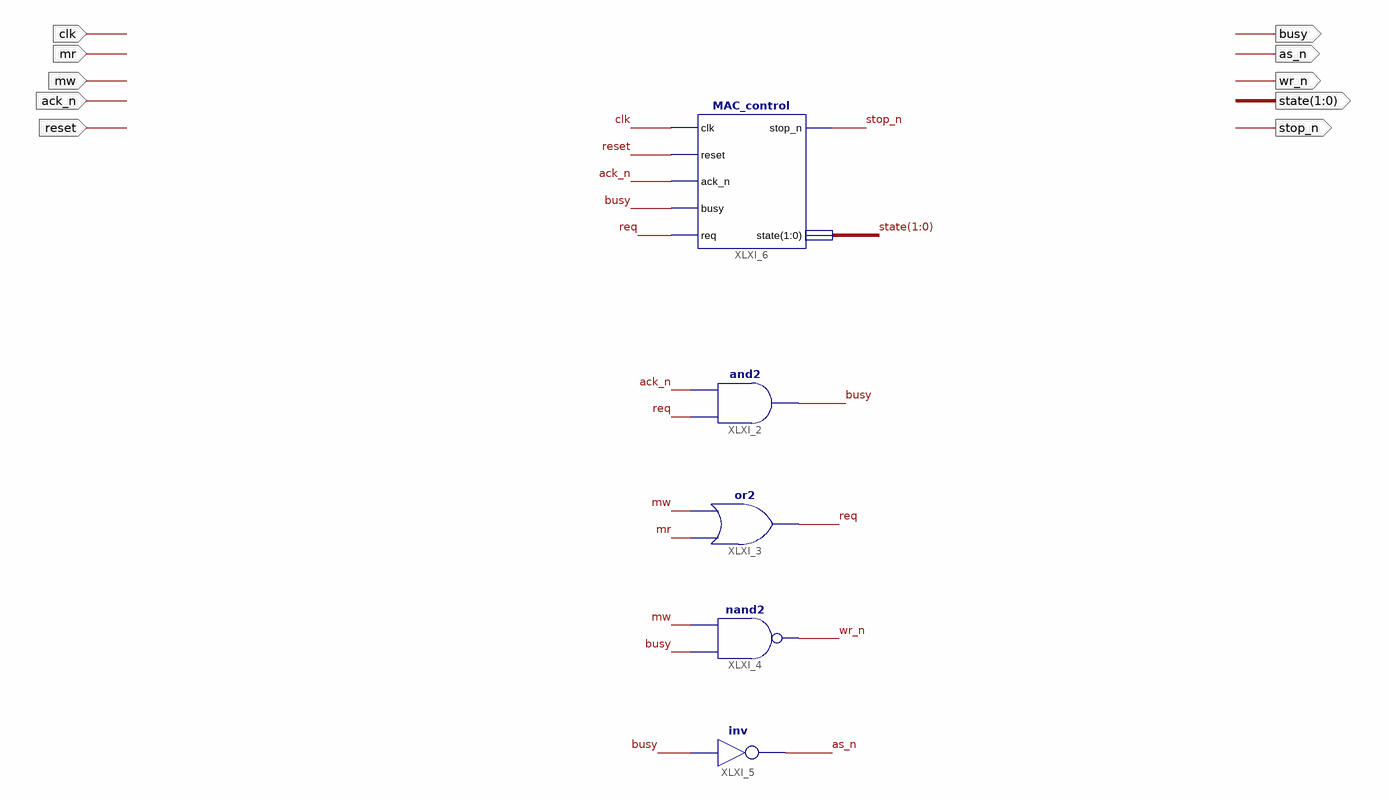
[diagram p0: schematic sheet 1]
// Xilinx ISE schematic MAC.sch (spartan6) as structural Verilog: 5 symbols, 10 ports
module MAC (
  input  clk,
  input  mr,
  input  mw,
  input  ack_n,
  input  reset,
  output busy,
  output as_n,
  output wr_n,
  output stop_n,
  output [1:0] state
);

  wire req;

  and XLXI_2 (busy, req, ack_n);
  or XLXI_3 (req, mr, mw);
  nand XLXI_4 (wr_n, busy, mw);
  not XLXI_5 (as_n, busy);
  MAC_control XLXI_6 (.clk(clk), .reset(reset), .ack_n(ack_n), .busy(busy), .req(req), .stop_n(stop_n), .state(state));
endmodule
